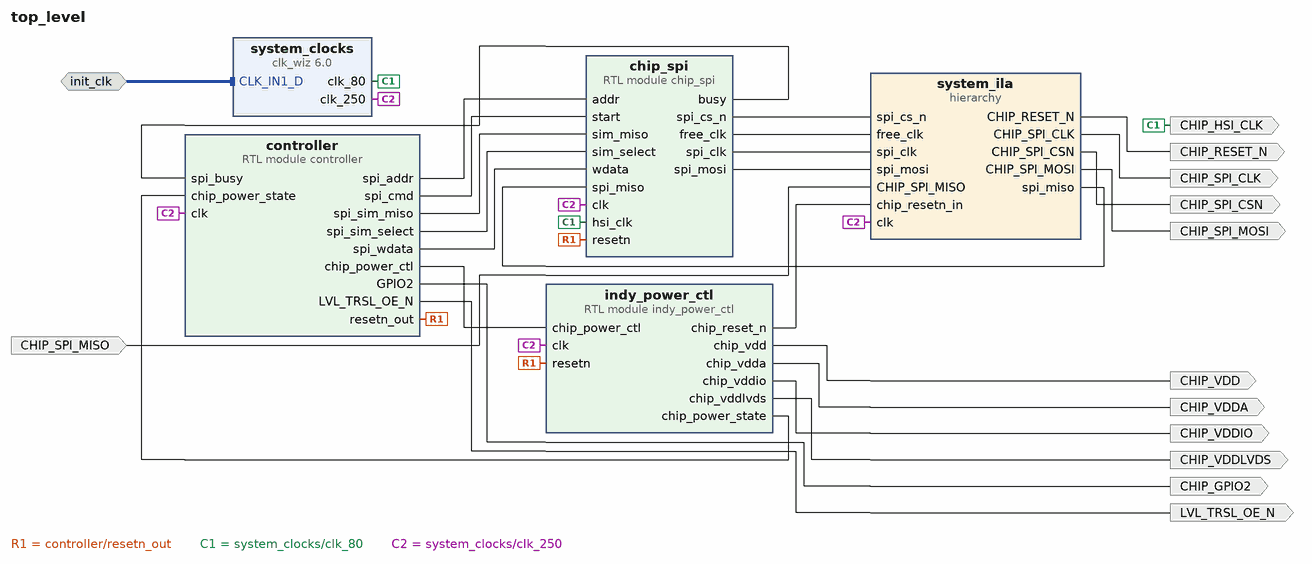
[diagram p0: block diagram of the top level]
# Vivado block design top_level, xcku15p-ffve1517-3-e, Vivado 2021.1
create_bd_design top_level

create_bd_intf_port -mode Slave -vlnv xilinx.com:interface:diff_clock_rtl:1.0 init_clk
set_property -dict {CONFIG.FREQ_HZ 200000000} [get_bd_intf_ports init_clk]
create_bd_port -dir O -type clk CHIP_HSI_CLK
create_bd_port -dir O CHIP_SPI_CSN
create_bd_port -dir O -type clk CHIP_SPI_CLK
create_bd_port -dir O CHIP_SPI_MOSI
create_bd_port -dir I CHIP_SPI_MISO
create_bd_port -dir O CHIP_GPIO2
create_bd_port -dir O CHIP_RESET_N
create_bd_port -dir O CHIP_VDDIO
create_bd_port -dir O CHIP_VDD
create_bd_port -dir O CHIP_VDDLVDS
create_bd_port -dir O CHIP_VDDA
create_bd_port -dir O LVL_TRSL_OE_N

create_bd_cell -type ip -vlnv xilinx.com:ip:clk_wiz:6.0 system_clocks
set_property -dict [list \
  CONFIG.CLKOUT1_JITTER 92.799 \
  CONFIG.CLKOUT1_PHASE_ERROR 82.655 \
  CONFIG.CLKOUT1_REQUESTED_OUT_FREQ 200 \
  CONFIG.CLKOUT2_JITTER 110.678 \
  CONFIG.CLKOUT2_PHASE_ERROR 82.655 \
  CONFIG.CLKOUT2_REQUESTED_OUT_FREQ 80 \
  CONFIG.CLKOUT2_USED true \
  CONFIG.CLKOUT3_JITTER 76.943 \
  CONFIG.CLKOUT3_PHASE_ERROR 127.216 \
  CONFIG.CLKOUT3_REQUESTED_OUT_FREQ 768 \
  CONFIG.CLKOUT3_USED false \
  CONFIG.CLK_OUT1_PORT clk_250 \
  CONFIG.CLK_OUT2_PORT clk_80 \
  CONFIG.CLK_OUT3_PORT clk_768 \
  CONFIG.MMCM_CLKFBOUT_MULT_F 6.000 \
  CONFIG.MMCM_CLKOUT0_DIVIDE_F 6.000 \
  CONFIG.MMCM_CLKOUT1_DIVIDE 15 \
  CONFIG.MMCM_CLKOUT2_DIVIDE 1 \
  CONFIG.MMCM_DIVCLK_DIVIDE 1 \
  CONFIG.NUM_OUT_CLKS 2 \
  CONFIG.PRIM_SOURCE Differential_clock_capable_pin \
  CONFIG.USE_LOCKED false \
  CONFIG.USE_RESET false \
] [get_bd_cells system_clocks]
create_bd_cell -type hier system_ila
create_bd_cell -type module -reference indy_power_ctl indy_power_ctl
create_bd_cell -type module -reference controller controller
create_bd_cell -type module -reference chip_spi chip_spi

# ---- hierarchy /system_ila ----
current_bd_instance /system_ila
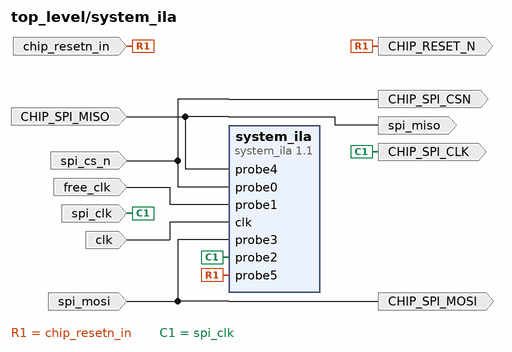
[diagram p1: block diagram inside /system_ila]
create_bd_pin -dir I -type clk clk
create_bd_pin -dir I spi_cs_n
create_bd_pin -dir O CHIP_SPI_CSN
create_bd_pin -dir I free_clk
create_bd_pin -dir I spi_clk
create_bd_pin -dir O CHIP_SPI_CLK
create_bd_pin -dir I spi_mosi
create_bd_pin -dir O CHIP_SPI_MOSI
create_bd_pin -dir I CHIP_SPI_MISO
create_bd_pin -dir O spi_miso
create_bd_pin -dir I chip_resetn_in
create_bd_pin -dir O CHIP_RESET_N

create_bd_cell -type ip -vlnv xilinx.com:ip:system_ila:1.1 system_ila
set_property -dict {CONFIG.C_DATA_DEPTH 4096 CONFIG.C_MON_TYPE NATIVE CONFIG.C_NUM_OF_PROBES 6} [get_bd_cells system_ila]

# ---- connections ----

current_bd_instance /system_ila
connect_bd_net [get_bd_pins CHIP_SPI_MISO] [get_bd_pins spi_miso] [get_bd_pins system_ila/probe4]
connect_bd_net -net SPI_CSN_1 [get_bd_pins spi_cs_n] [get_bd_pins CHIP_SPI_CSN] [get_bd_pins system_ila/probe0]
connect_bd_net [get_bd_pins chip_resetn_in] [get_bd_pins CHIP_RESET_N] [get_bd_pins system_ila/probe5]
connect_bd_net [get_bd_pins free_clk] [get_bd_pins system_ila/probe1]
connect_bd_net [get_bd_pins spi_clk] [get_bd_pins CHIP_SPI_CLK] [get_bd_pins system_ila/probe2]
connect_bd_net [get_bd_pins spi_mosi] [get_bd_pins CHIP_SPI_MOSI] [get_bd_pins system_ila/probe3]
connect_bd_net -net sys_clks_clk_250 [get_bd_pins clk] [get_bd_pins system_ila/clk]

current_bd_instance /
connect_bd_intf_net [get_bd_intf_ports init_clk] [get_bd_intf_pins system_clocks/CLK_IN1_D]
connect_bd_net -net CHIP_SPI_CSN_1 [get_bd_pins chip_spi/spi_cs_n] [get_bd_pins system_ila/spi_cs_n]
connect_bd_net [get_bd_ports CHIP_SPI_MISO] [get_bd_pins system_ila/CHIP_SPI_MISO]
connect_bd_net [get_bd_pins chip_spi/busy] [get_bd_pins controller/spi_busy]
connect_bd_net [get_bd_pins chip_spi/free_clk] [get_bd_pins system_ila/free_clk]
connect_bd_net [get_bd_pins chip_spi/spi_clk] [get_bd_pins system_ila/spi_clk]
connect_bd_net -net controller_0_GPIO2 [get_bd_pins controller/GPIO2] [get_bd_ports CHIP_GPIO2]
connect_bd_net -net controller_0_spi_addr [get_bd_pins controller/spi_addr] [get_bd_pins chip_spi/addr]
connect_bd_net -net controller_0_spi_cmd [get_bd_pins controller/spi_cmd] [get_bd_pins chip_spi/start]
connect_bd_net -net controller_0_spi_sim_miso [get_bd_pins controller/spi_sim_miso] [get_bd_pins chip_spi/sim_miso]
connect_bd_net -net controller_0_spi_sim_select [get_bd_pins controller/spi_sim_select] [get_bd_pins chip_spi/sim_select]
connect_bd_net -net controller_0_spi_wdata [get_bd_pins controller/spi_wdata] [get_bd_pins chip_spi/wdata]
connect_bd_net [get_bd_pins controller/LVL_TRSL_OE_N] [get_bd_ports LVL_TRSL_OE_N]
connect_bd_net [get_bd_pins controller/chip_power_ctl] [get_bd_pins indy_power_ctl/chip_power_ctl]
connect_bd_net [get_bd_pins controller/resetn_out] [get_bd_pins indy_power_ctl/resetn] [get_bd_pins chip_spi/resetn]
connect_bd_net [get_bd_pins indy_power_ctl/chip_power_state] [get_bd_pins controller/chip_power_state]
connect_bd_net [get_bd_pins indy_power_ctl/chip_reset_n] [get_bd_pins system_ila/chip_resetn_in]
connect_bd_net [get_bd_pins indy_power_ctl/chip_vdd] [get_bd_ports CHIP_VDD]
connect_bd_net [get_bd_pins indy_power_ctl/chip_vdda] [get_bd_ports CHIP_VDDA]
connect_bd_net [get_bd_pins indy_power_ctl/chip_vddio] [get_bd_ports CHIP_VDDIO]
connect_bd_net [get_bd_pins indy_power_ctl/chip_vddlvds] [get_bd_ports CHIP_VDDLVDS]
connect_bd_net -net spi_mosi_1 [get_bd_pins chip_spi/spi_mosi] [get_bd_pins system_ila/spi_mosi]
connect_bd_net -net sys_clks_clk_80 [get_bd_pins system_clocks/clk_80] [get_bd_ports CHIP_HSI_CLK] [get_bd_pins chip_spi/hsi_clk]
connect_bd_net -net sys_clks_clk_250 [get_bd_pins system_clocks/clk_250] \
  [get_bd_pins system_ila/clk] [get_bd_pins indy_power_ctl/clk] [get_bd_pins controller/clk] [get_bd_pins chip_spi/clk]
connect_bd_net [get_bd_pins system_ila/CHIP_RESET_N] [get_bd_ports CHIP_RESET_N]
connect_bd_net [get_bd_pins system_ila/CHIP_SPI_CLK] [get_bd_ports CHIP_SPI_CLK]
connect_bd_net [get_bd_pins system_ila/CHIP_SPI_MOSI] [get_bd_ports CHIP_SPI_MOSI]
connect_bd_net -net system_ila_EXT_CHIP_SPI_CSN [get_bd_pins system_ila/CHIP_SPI_CSN] [get_bd_ports CHIP_SPI_CSN]
connect_bd_net [get_bd_pins system_ila/spi_miso] [get_bd_pins chip_spi/spi_miso]

validate_bd_design
save_bd_design
